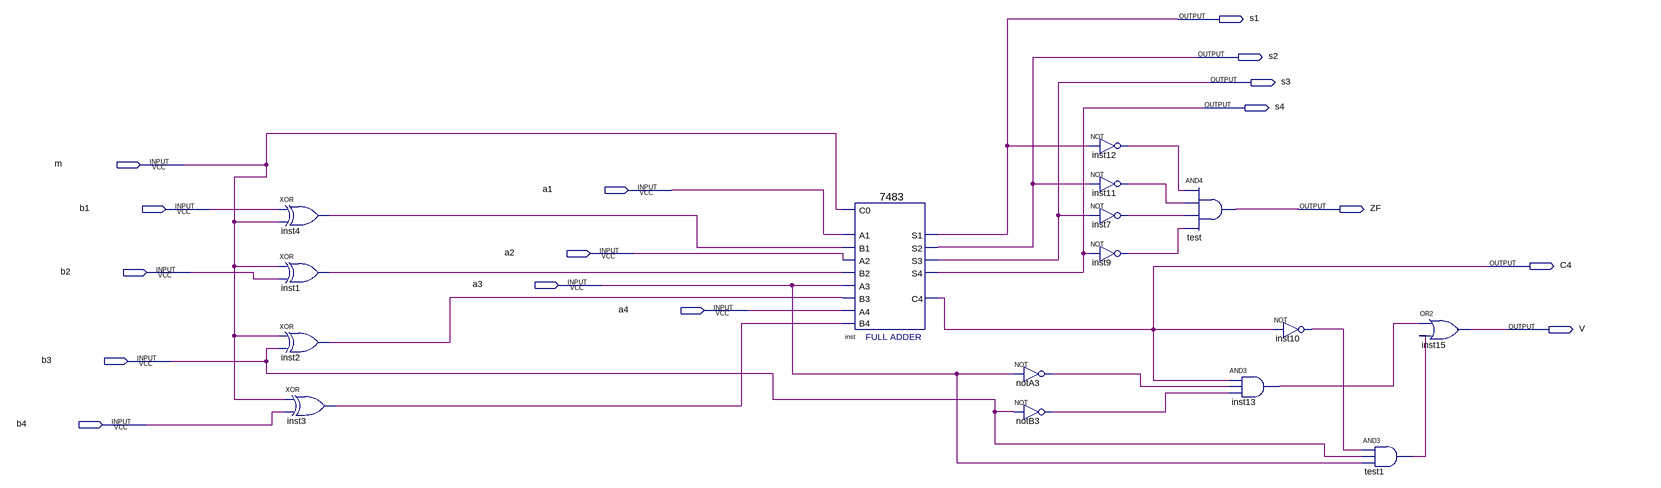
[diagram p0: schematic sheet]
// Quartus schematic add_sub.bdf as structural Verilog: 16 symbols, 16 pins
module add_sub (
  input  m,
  input  a1,
  input  b1,
  input  a2,
  input  b2,
  input  a3,
  input  a4,
  input  b3,
  input  b4,
  output s1,
  output s2,
  output s3,
  output s4,
  output ZF,
  output C4,
  output V
);

  wire inst1_out, inst2_out, inst3_out, inst4_out, inst7_out, inst9_out, inst10_out, inst11_out, inst12_out,
       inst13_out, notA3_out, notB3_out, test1_out;

  xor inst4 (inst4_out, b1, m);
  xor inst1 (inst1_out, m, b2);
  xor inst2 (inst2_out, m, b3);
  xor inst3 (inst3_out, m, b4);
  \7483  inst (
    .B4(inst3_out), .C0(m), .A1(a1), .A2(a2), .B1(inst4_out), .B2(inst1_out), .A3(a3), .B3(inst2_out),
    .A4(a4), .S3(s3), .S4(s4), .S2(s2), .C4(C4), .S1(s1));
  not notA3 (notA3_out, a3);
  not notB3 (notB3_out, b3);
  not inst12 (inst12_out, s1);
  not inst11 (inst11_out, s2);
  not inst7 (inst7_out, s3);
  not inst9 (inst9_out, s4);
  and test (ZF, inst12_out, inst11_out, inst7_out, inst9_out);
  not inst10 (inst10_out, C4);
  and inst13 (inst13_out, C4, notA3_out, notB3_out);
  and test1 (test1_out, inst10_out, b3, a3);
  or inst15 (V, inst13_out, test1_out);
endmodule
